# EAGLE board mainboard_eurobotics2010_r14 (EAGLE 4.16), part 1 of 2
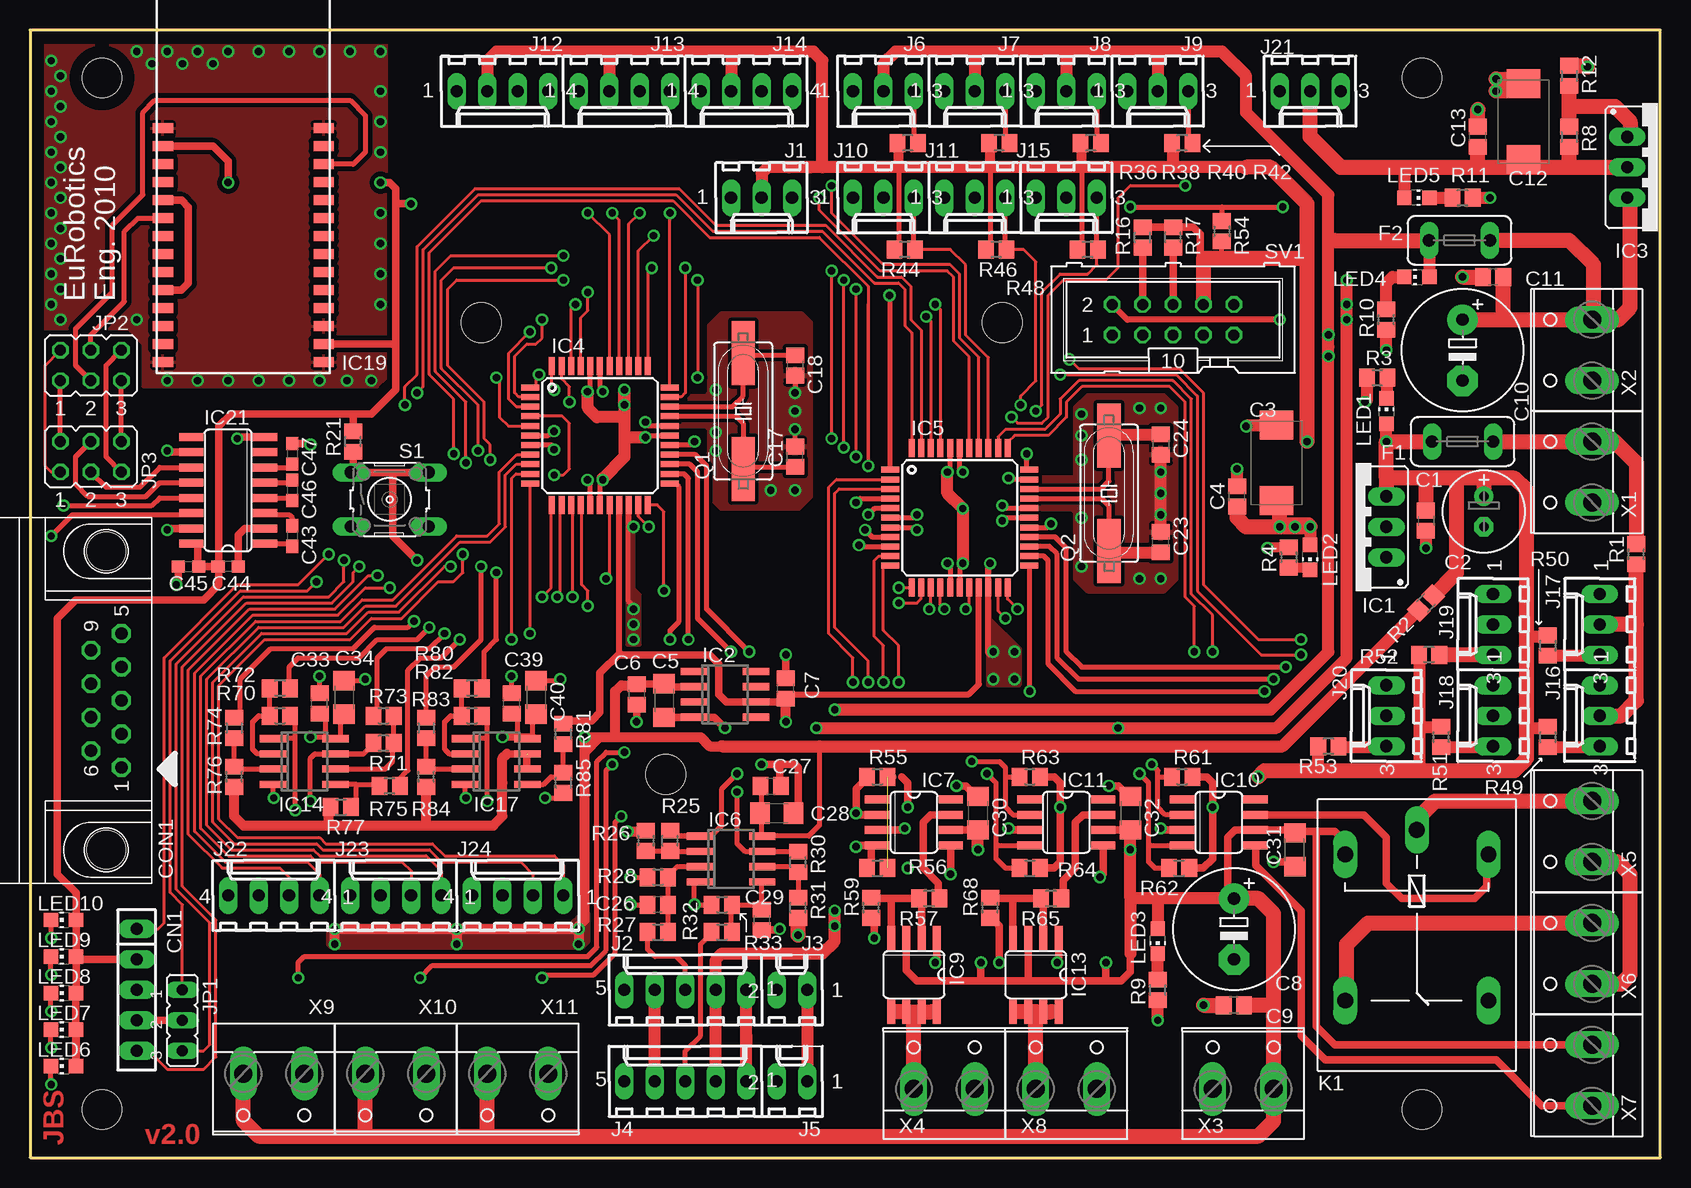
[diagram p9: board, top side]
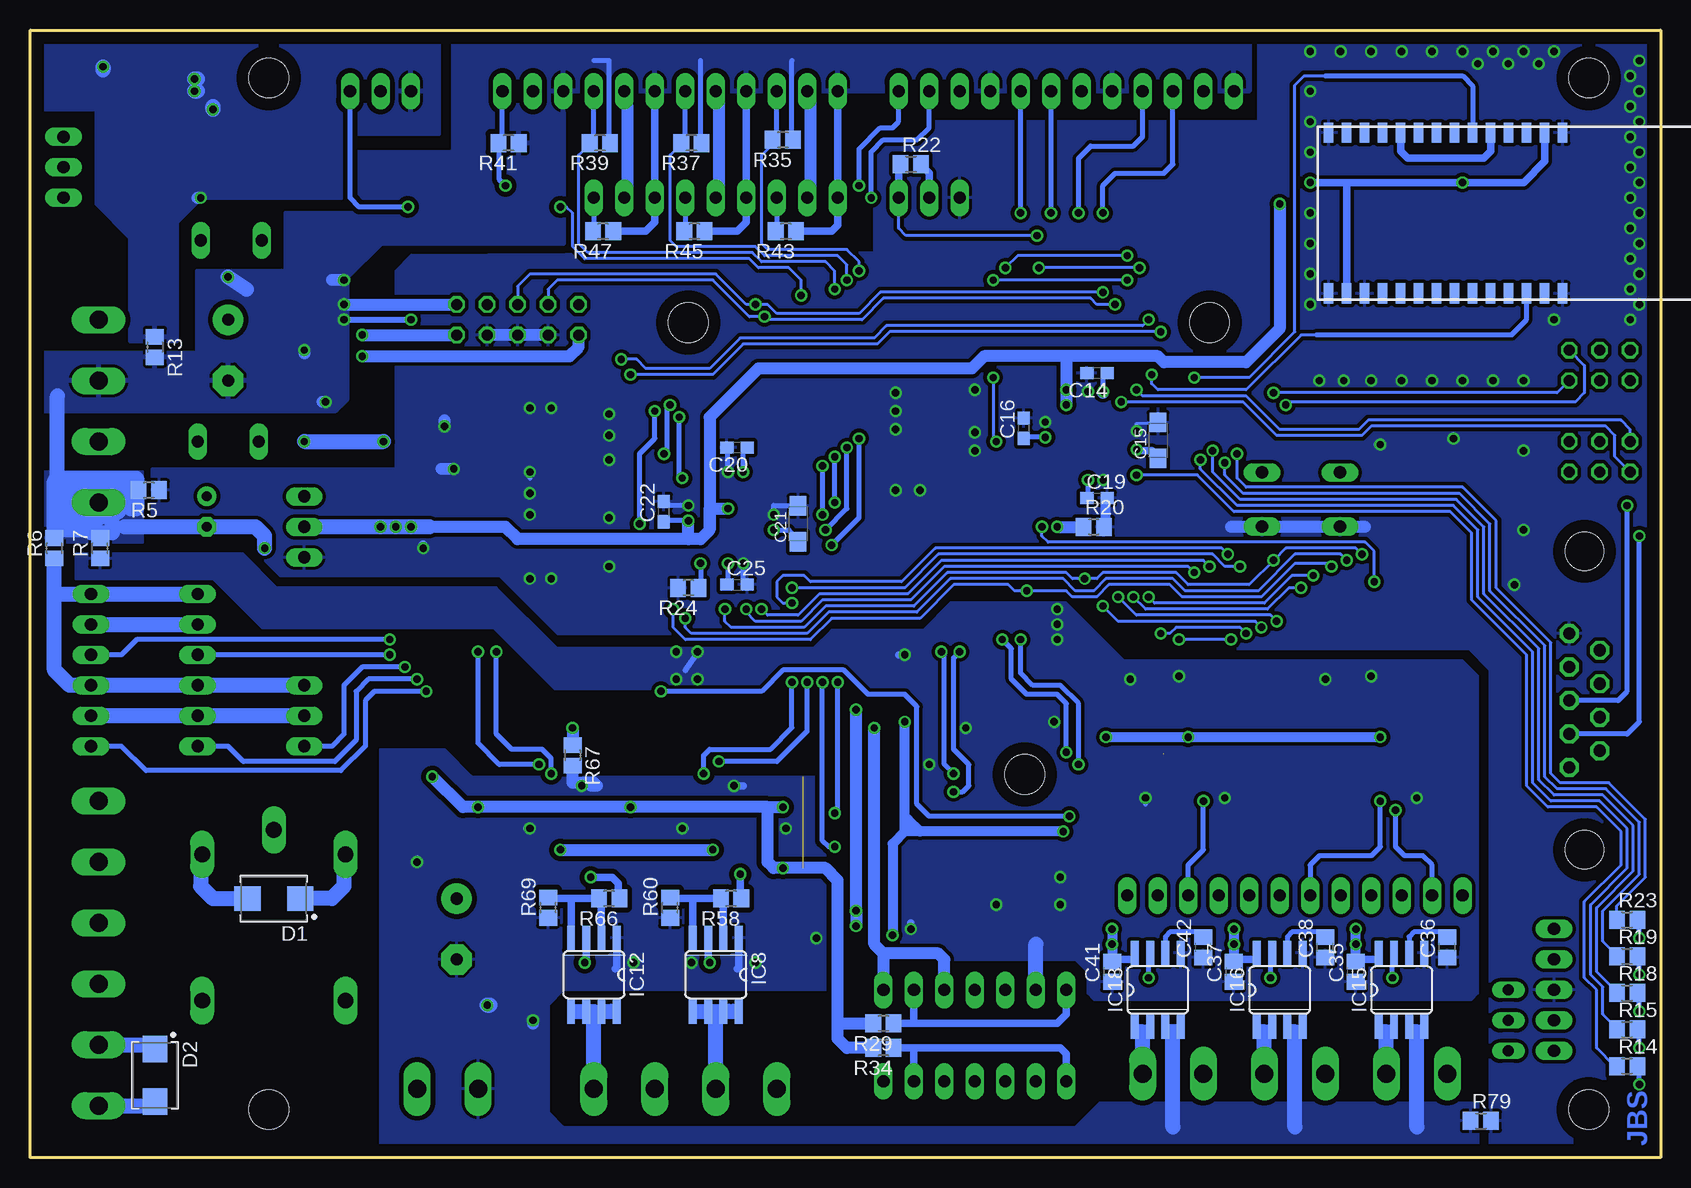
[diagram p10: board, bottom side, seen from below]

Size 135.89 x 94 mm. Coordinates in mm from the lower left corner, seen from the top.
Outline: 135.86,93.98 135.86,0.03 135.89,0 0,0 0,94 135.86,94
Copper layers (1*16): Top 0.035mm / dielectric 1.5mm / Bottom 0.035mm
Design rules "olimex": minimum track width 10mil, minimum drill 24mil, track to track 8mil, track to pad 8mil, pad to pad 8mil, via to via 8mil, smd to smd 8mil, copper to edge 40mil, drill to drill 8mil, minimum pad ring 8mil, minimum via ring 8mil, stop-mask expansion 4mil, vias tented up to drill 0mil, thermal gap 10mil
Holes 3.3 mm at 6,4 116,4 6,90 116,90 52.99,31.94 37.59,69.6 81.03,69.6

## Footprints (pad centres in the part's own frame; a part is rotated, then mirrored left to right if it is on the bottom)
C0805 = smd 1.3 x 1.5: 1 -0.85,0; 2 0.85,0
E2,5-7 = drill 0.813 pad 1.6 round: + -1.27,0 | drill 0.813 pad 1.6 octagon: - 1.27,0
SMC_D = smd 2.4 x 2.8: + -3.15,0; - 3.15,0
C1206 = smd 1.6 x 1.8: 1 -1.4,0; 2 1.4,0
E5-10,5 = drill 1.016 pad 2.54 round: + -2.54,0 | drill 1.016 pad 2.54 octagon: - 2.54,0
C0603 = smd 1.1 x 1: 1 -0.85,0; 2 0.85,0
SMC_A = smd 1.6 x 1.4: + -1.5,0; - 1.5,0
SIP-100-5V = drill 1.016 long: 1 -5.08,0; 2 -2.54,0; 3 0,0; 4 2.54,0; 5 5.08,0
D-09F/90 = drill 1.016 pad 1.575 octagon: 1 -5.588,-1.27; 2 -2.794,-1.27; 3 0,-1.27; 4 2.794,-1.27; 5 5.588,-1.27; 6 -4.191,1.27; 7 -1.397,1.27; 8 1.397,1.27; 9 4.191,1.27 | hole 3.2: 12.446,0; -12.446,0
DIOM5436X265N = smd 2.2 x 2.05: A 2.2,0; K -2.2,0
TE5 = drill 1.016 long: 1 -2.54,0; 2 2.54,0
317TS = drill 1.016 long: 1 -2.54,-2.54; 2 0,-2.54; 3 2.54,-2.54
SOIC8 = smd 0.6 x 2.2: 1 -1.905,-2.6; 2 -0.635,-2.6; 3 0.635,-2.6; 4 1.905,-2.6; 5 1.905,2.6; 6 0.635,2.6; 7 -0.635,2.6; 8 -1.905,2.6
TQFP44 = smd 1.5 x 0.5: 1 -5.8,4; 2 -5.8,3.2; 3 -5.8,2.4; 4 -5.8,1.6; 5 -5.8,0.8; 6 -5.8,0; 7 -5.8,-0.8; 8 -5.8,-1.6; 9 -5.8,-2.4; 10 -5.8,-3.2; 11 -5.8,-4; 23 5.8,-4; 24 5.8,-3.2; 25 5.8,-2.4; 26 5.8,-1.6; 27 5.8,-0.8; 28 5.8,0; 29 5.8,0.8; 30 5.8,1.6; 31 5.8,2.4; 32 5.8,3.2; 33 5.8,4 | smd 0.5 x 1.5: 12 -4,-5.8; 13 -3.2,-5.8; 14 -2.4,-5.8; 15 -1.6,-5.8; 16 -0.8,-5.8; 17 0,-5.8; 18 0.8,-5.8; 19 1.6,-5.8; 20 2.4,-5.8; 21 3.2,-5.8; 22 4,-5.8; 34 4,5.8; 35 3.2,5.8; 36 2.4,5.8; 37 1.6,5.8; 38 0.8,5.8; 39 0,5.8; 40 -0.8,5.8; 41 -1.6,5.8; 42 -2.4,5.8; 43 -3.2,5.8; 44 -4,5.8
SO08 = smd 0.6 x 2.2: 1 -1.905,-2.6; 2 -0.635,-2.6; 3 0.635,-2.6; 4 1.905,-2.6; 5 1.905,2.6; 6 0.635,2.6; 7 -0.635,2.6; 8 -1.905,2.6
SO08' = smd 0.66 x 2.032: 1 -1.905,-3.073; 2 -0.635,-3.073; 3 0.635,-3.073; 4 1.905,-3.073; 5 1.905,3.073; 6 0.635,3.073; 7 -0.635,3.073; 8 -1.905,3.073
WT11 = smd 1.7 x 0.8: 1 -6.7,2.5; 2 -6.7,1; 3 -6.7,-0.5; 4 -6.7,-2; 5 -6.7,-3.5; 6 -6.7,-5; 7 -6.7,-6.5; 8 -6.7,-8; 9 -6.7,-9.5; 10 -6.7,-11; 11 -6.7,-12.5; 12 -6.7,-14; 13 -6.7,-15.5; 14 -6.7,-17; 15 6.7,-17; 16 6.7,-15.5; 17 6.7,-14; 18 6.7,-12.5; 19 6.7,-11; 20 6.7,-9.5; 21 6.7,-8; 22 6.7,-6.5; 23 6.7,-5; 24 6.7,-3.5; 25 6.7,-2; 26 6.7,-0.5; 27 6.7,1; 28 6.7,2.5
SO16 = smd 0.66 x 2.032: 1 -4.445,-3.073; 2 -3.175,-3.073; 3 -1.905,-3.073; 4 -0.635,-3.073; 5 0.635,-3.073; 6 1.905,-3.073; 7 3.175,-3.073; 8 4.445,-3.073; 9 4.445,3.073; 10 3.175,3.073; 11 1.905,3.073; 12 0.635,3.073; 13 -0.635,3.073; 14 -1.905,3.073; 15 -3.175,3.073; 16 -4.445,3.073
6410-03 = drill 1.016 long: 1 2.54,0; 2 0,0; 3 -2.54,0
6410-05 = drill 1.016 long: 1 5.08,0; 2 2.54,0; 3 0,0; 4 -2.54,0; 5 -5.08,0
6410-02 = drill 1.016 long: 1 1.27,0; 2 -1.27,0
6410-04 = drill 1.016 long: 1 3.81,0; 2 1.27,0; 3 -1.27,0; 4 -3.81,0
JP2 = drill 0.914 long: 1 -2.54,0; 2 0,0; 3 2.54,0
JP3Q = drill 0.914 octagon: 1 -2.54,-1.27; 2 -2.54,1.27; 3 0,-1.27; 4 0,1.27; 5 2.54,-1.27; 6 2.54,1.27
G5LE = drill 1.321 long: 1 -7.493,-5.969; 2 -7.493,5.969; O 4.699,5.969; P -9.525,0; S 4.699,-5.969
CHIP-LED0805 = smd 1.2 x 1.2: A 0,-1.05; C 0,1.05
HC49UP = smd 5.334 x 1.93: 1 -4.826,0; 2 4.826,0
R0805 = smd 1.3 x 1.5: 1 -0.85,0; 2 0.85,0
B3F-10XX = drill 1.016 long: 1 -3.251,2.261; 2 3.251,2.261; 3 -3.251,-2.261; 4 3.251,-2.261
ML10 = drill 0.914 octagon: 1 -5.08,-1.27; 2 -5.08,1.27; 3 -2.54,-1.27; 4 -2.54,1.27; 5 0,-1.27; 6 0,1.27; 7 2.54,-1.27; 8 2.54,1.27; 9 5.08,-1.27; 10 5.08,1.27
W237-132 = drill 1.499 long: 1 -2.54,-0.635; 2 2.54,-0.635

## Placement (x,y rotation side)
C1  100nF  [C0805]  116.33,53.09 270 top
C2  220uF/10V  [E2,5-7]  121.16,53.85 270 top
C3  47uF/6V  [SMC_D]  103.89,57.91 90 top
C4  100nF  [C0805]  100.58,55.12 90 top
C5  10uF/10V  [C1206]  52.83,38.1 270 top
C6  100nF  [C0805]  50.55,38.61 270 top
C7  100nF  [C0805]  62.99,39.12 90 top
C8  220uF/35V  [E5-10,5]  100.33,19.05 270 top
C9  100nF  [C0805]  100.33,12.7 180 top
C10  220uF/35V  [E5-10,5]  119.38,67.31 270 top
C11  100nF  [C0805]  121.92,73.41 180 top
C12  47uF/16V  [SMC_D]  124.46,86.36 90 top
C13  100nF  [C0805]  120.65,85.09 90 top
C14  100nF  [C0603]  46.96,65.38 180 bottom
C15  10uF/6V/lowESR  [SMC_A]  41.88,59.79 90 bottom
C16  100nF  [C0603]  53.06,60.81 90 bottom
C17  22pF  [C0805]  63.75,58.42 90 top
C18  22pF  [C0805]  63.75,66.04 270 top
C19  100nF  [C0603]  46.96,54.96 0 bottom
C20  100nF  [C0603]  76.96,59.18 180 bottom
C21  10uF/6V/lowESR  [SMC_A]  71.88,52.83 90 bottom
C22  100nF  [C0603]  83.06,53.85 90 bottom
C23  22pF  [C0805]  94.23,51.31 90 top
C24  22pF  [C0805]  94.23,59.44 270 top
C25  100nF  [C0603]  76.96,47.75 0 bottom
C26  CA  [C0805]  52.32,21.08 180 top
C27  100nF  [C0805]  61.72,30.99 0 top
C28  10uF/10V  [C1206]  62.23,28.7 180 top
C29  CA  [C0805]  60.96,19.81 270 top
C30  10uF/35V  [C1206]  78.99,28.7 270 top
C31  10uF/35V  [C1206]  105.41,25.65 90 top
C32  10uF/35V  [C1206]  91.69,28.7 270 top
C33  100nF  [C0805]  24.13,37.85 90 top
C34  10uF/10V  [C1206]  26.16,38.35 270 top
C35  100nF  [C0805]  25.4,15.49 90 bottom
C36  100nF  [C0805]  17.78,17.53 90 bottom
C37  100nF  [C0805]  35.56,15.49 90 bottom
C38  100nF  [C0805]  27.94,17.53 90 bottom
C39  100nF  [C0805]  40.13,37.85 90 top
C40  10uF/10V  [C1206]  42.16,38.35 270 top
C41  100nF  [C0805]  45.72,15.49 90 bottom
C42  100nF  [C0805]  38.1,17.53 90 bottom
C43  100nF  [C0603]  21.84,51.82 270 top
C44  100nF  [C0603]  16.51,49.28 180 top
C45  100nF  [C0603]  13.21,49.28 0 top
C46  100nF  [C0603]  21.84,55.63 270 top
C47  100nF  [C0603]  21.84,58.67 270 top
CN1  [SIP-100-5V]  8.89,13.97 270 top
CON1  [D-09F/90]  6.35,38.1 90 top
D1  SS24  [DIOM5436X265N]  115.57,21.59 180 bottom
D2  SS24  [DIOM5436X265N]  125.48,6.86 270 bottom
F1  FUSETE5  [TE5]  119.38,59.69 180 top
F2  FUSETE5  [TE5]  119.13,76.45 180 top
IC1  LM1086CT-3.3  [317TS]  110.49,52.58 90 top
IC2  ADR443BRZ-R-8  [SOIC8]  57.91,38.61 270 top
IC3  LM338T  [317TS]  135.64,82.55 270 top
IC4  DSPIC33FJ128MC804-I/PT  [TQFP44]  47.5,60.2 0 top
IC5  DSPIC33FJ128MC804-I/PT  [TQFP44]  77.47,53.34 0 top
IC6  MCP6022SN  [SO08]  58.42,24.89 270 top
IC7  TC4427  [SO08']  73.66,27.94 270 top
IC8  IRF7389  [SO08']  78.74,15.24 180 bottom
IC9  IRF7389  [SO08']  73.66,15.24 180 top
IC10  TC4427  [SO08']  99.06,27.94 270 top
IC11  TC4427  [SO08']  86.36,27.94 270 top
IC12  IRF7389  [SO08']  88.9,15.24 180 bottom
IC13  IRF7389  [SO08']  83.82,15.24 180 top
IC14  MCP6022SN  [SO08]  22.86,33.02 270 top
IC15  ACS713  [SO08']  21.59,13.97 0 bottom
IC16  ACS713  [SO08']  31.75,13.97 0 bottom
IC17  MCP6022SN  [SO08]  38.86,33.02 270 top
IC18  ACS713  [SO08']  41.91,13.97 0 bottom
IC19  WT11A  [WT11]  17.78,83.31 0 top
IC20  WT11A  [WT11]  10.67,78.74 270 bottom
IC21  MAX232ACSE  [SO16]  16.51,55.63 90 top
J1  22-27-2031-03  [6410-03]  60.96,80.01 180 top
J2  22-27-2051-05  [6410-05]  54.61,13.97 0 top
J3  22-27-2021-02  [6410-02]  63.5,13.97 0 top
J4  22-27-2051-05  [6410-05]  54.61,6.35 0 top
J5  22-27-2021-02  [6410-02]  63.5,6.35 0 top
J6  22-27-2031-03  [6410-03]  71.12,88.9 180 top
J7  22-27-2031-03  [6410-03]  78.74,88.9 180 top
J8  22-27-2031-03  [6410-03]  86.36,88.9 180 top
J9  22-27-2031-03  [6410-03]  93.98,88.9 180 top
J10  22-27-2031-03  [6410-03]  71.12,80.01 180 top
J11  22-27-2031-03  [6410-03]  78.74,80.01 180 top
J12  22-27-2041-04  [6410-04]  39.37,88.9 180 top
J13  22-27-2041-04  [6410-04]  49.53,88.9 180 top
J14  22-27-2041-04  [6410-04]  59.69,88.9 180 top
J15  22-27-2031-03  [6410-03]  86.36,80.01 180 top
J16  22-27-2031-03  [6410-03]  130.81,36.83 90 top
J17  22-27-2031-03  [6410-03]  130.81,44.45 90 top
J18  22-27-2031-03  [6410-03]  121.92,36.83 90 top
J19  22-27-2031-03  [6410-03]  121.92,44.45 90 top
J20  22-27-2031-03  [6410-03]  113.03,36.83 90 top
J21  22-27-2031-03  [6410-03]  106.68,88.9 180 top
J22  22-27-2041-04  [6410-04]  20.32,21.84 0 top
J23  22-27-2041-04  [6410-04]  30.48,21.84 0 top
J24  22-27-2041-04  [6410-04]  40.64,21.84 0 top
JP1  [JP2]  12.7,11.43 270 top
JP2  [JP3Q]  5.08,66.04 0 top
JP3  [JP3Q]  5.08,58.42 0 top
K1  G5LE  [G5LE]  115.57,17.78 270 top
LED1  Green  [CHIP-LED0805]  113.03,62.23 0 top
LED2  Green  [CHIP-LED0805]  106.68,50.04 180 top
LED3  Green  [CHIP-LED0805]  93.98,18.03 180 top
LED4  Green  [CHIP-LED0805]  115.57,73.41 90 top
LED5  [CHIP-LED0805]  115.57,80.01 270 top
LED6  Red  [CHIP-LED0805]  2.79,7.62 90 top
LED7  Red  [CHIP-LED0805]  2.79,10.67 90 top
LED8  Red  [CHIP-LED0805]  2.79,13.72 90 top
LED9  Red  [CHIP-LED0805]  2.79,16.76 90 top
LED10  Red  [CHIP-LED0805]  2.79,19.81 90 top
Q1  10MHz  [HC49UP]  59.44,62.23 90 top
Q2  10MHz  [HC49UP]  89.92,55.37 90 top
R1  0R  [R0805]  133.86,50.29 90 top
R2  0R  [R0805]  116.33,46.23 45 top
R3  470R  [R0805]  112.27,65.02 0 top
R4  270R  [R0805]  104.9,50.04 270 top
R5  0R  [R0805]  125.98,55.63 180 bottom
R6  0R  [R0805]  133.86,50.8 90 bottom
R7  0R  [R0805]  130.05,50.8 90 bottom
R8  240R/1%  [R0805]  128.27,85.09 270 top
R9  2K7  [R0805]  93.98,13.97 90 top
R10  1K  [R0805]  113.03,69.85 90 top
R11  1K  [R0805]  119.38,80.01 180 top
R12  1K6/1%  [R0805]  128.27,90.17 270 top
R13  0R  [R0805]  125.48,67.56 270 bottom
R14  270R  [R0805]  2.79,7.62 0 bottom
R15  270R  [R0805]  2.79,10.67 0 bottom
R16  4K7  [R0805]  92.71,76.71 90 top
R17  4K7  [R0805]  95.25,76.71 90 top
R18  270R  [R0805]  2.79,13.72 0 bottom
R19  270R  [R0805]  2.79,16.76 0 bottom
R20  0R  [R0805]  47.24,52.58 0 bottom
R21  10K  [R0805]  26.92,59.69 90 top
R22  4K7  [R0805]  62.48,82.8 0 bottom
R23  270R  [R0805]  2.79,19.81 0 bottom
R24  0R  [R0805]  81.03,47.5 180 bottom
R25  RD  [R0805]  53.34,26.42 90 top
R26  RC  [R0805]  51.31,26.42 270 top
R27  RA  [R0805]  52.32,18.8 0 top
R28  RB  [R0805]  52.32,23.37 0 top
R29  4K7  [R0805]  64.77,11.18 180 bottom
R30  RD  [R0805]  64.01,24.64 90 top
R31  RC  [R0805]  64.01,20.83 90 top
R32  RA  [R0805]  57.66,18.8 0 top
R33  RB  [R0805]  57.66,21.08 0 top
R34  4K7  [R0805]  64.77,9.14 180 bottom
R35  NC  [R0805]  73.15,84.84 180 bottom
R36  4K7  [R0805]  73.15,84.58 180 top
R37  NC  [R0805]  80.77,84.58 180 bottom
R38  4K7  [R0805]  80.77,84.58 180 top
R39  NC  [R0805]  88.39,84.58 180 bottom
R40  4K7  [R0805]  88.39,84.58 180 top
R41  NC  [R0805]  96.01,84.58 180 bottom
R42  4K7  [R0805]  96.01,84.58 180 top
R43  NC  [R0805]  72.9,77.22 180 bottom
R44  4K7  [R0805]  72.9,75.69 180 top
R45  NC  [R0805]  80.52,77.22 180 bottom
R46  4K7  [R0805]  80.52,75.69 180 top
R47  NC  [R0805]  88.14,77.22 180 bottom
R48  4K7  [R0805]  88.14,75.69 180 top
R49  4K7  [R0805]  126.49,35.05 90 top
R50  4K7  [R0805]  126.49,42.67 90 top
R51  4K7  [R0805]  117.6,35.05 90 top
R52  4K7  [R0805]  116.59,41.91 180 top
R53  4K7  [R0805]  108.2,34.29 180 top
R54  4K7  [R0805]  99.31,77.22 270 top
R55  2K2  [R0805]  70.61,31.75 0 top
R56  2K2  [R0805]  70.61,24.13 0 top
R57  22R  [R0805]  74.93,21.59 180 top
R58  22R  [R0805]  77.47,21.59 180 bottom
R59  2K2  [R0805]  70.1,20.83 90 top
R60  2K2  [R0805]  82.55,20.83 90 bottom
R61  2K2  [R0805]  96.01,31.75 0 top
R62  2K2  [R0805]  95.76,24.13 0 top
R63  2K2  [R0805]  83.31,31.75 0 top
R64  2K2  [R0805]  83.31,24.13 0 top
R65  22R  [R0805]  85.09,21.59 180 top
R66  22R  [R0805]  87.63,21.59 180 bottom
R67  0R  [R0805]  90.68,33.53 270 bottom
R68  2K2  [R0805]  80.01,20.83 90 top
R69  2K2  [R0805]  92.71,20.83 90 bottom
R70  20K/1%  [R0805]  20.83,36.83 0 top
R71  20K/1%  [R0805]  29.46,34.54 180 top
R72  10K/1%  [R0805]  20.83,39.12 180 top
R73  10K/1%  [R0805]  29.46,36.83 0 top
R74  10K/1%  [R0805]  17.02,35.81 270 top
R75  10K/1%  [R0805]  29.97,30.99 180 top
R76  20K/1%  [R0805]  17.02,31.75 90 top
R77  20K/1%  [R0805]  25.91,29.21 0 top
R79  0R  [R0805]  14.99,3.05 0 bottom
R80  20K/1%  [R0805]  36.83,36.83 0 top
R81  1K/1%  [R0805]  44.45,35.31 90 top
R82  10K/1%  [R0805]  36.83,39.12 180 top
R83  10K/1%  [R0805]  33.02,35.81 270 top
R84  20K/1%  [R0805]  33.02,31.75 90 top
R85  2K/1%  [R0805]  44.45,31.24 90 top
S1  [B3F-10XX]  29.97,54.86 0 top
SV1  [ML10]  95.25,69.85 0 top
X1  [W237-132]  129.54,57.15 90 top
X2  [W237-132]  129.54,67.31 90 top
X3  [W237-132]  101.09,6.35 0 top
X4  [W237-132]  76.2,6.35 0 top
X5  [W237-132]  129.54,27.18 90 top
X6  [W237-132]  129.54,17.02 90 top
X7  [W237-132]  129.54,6.86 90 top
X8  [W237-132]  86.36,6.35 0 top
X9  [W237-132]  20.32,6.35 180 top
X10  [W237-132]  30.48,6.35 180 top
X11  [W237-132]  40.64,6.35 180 top